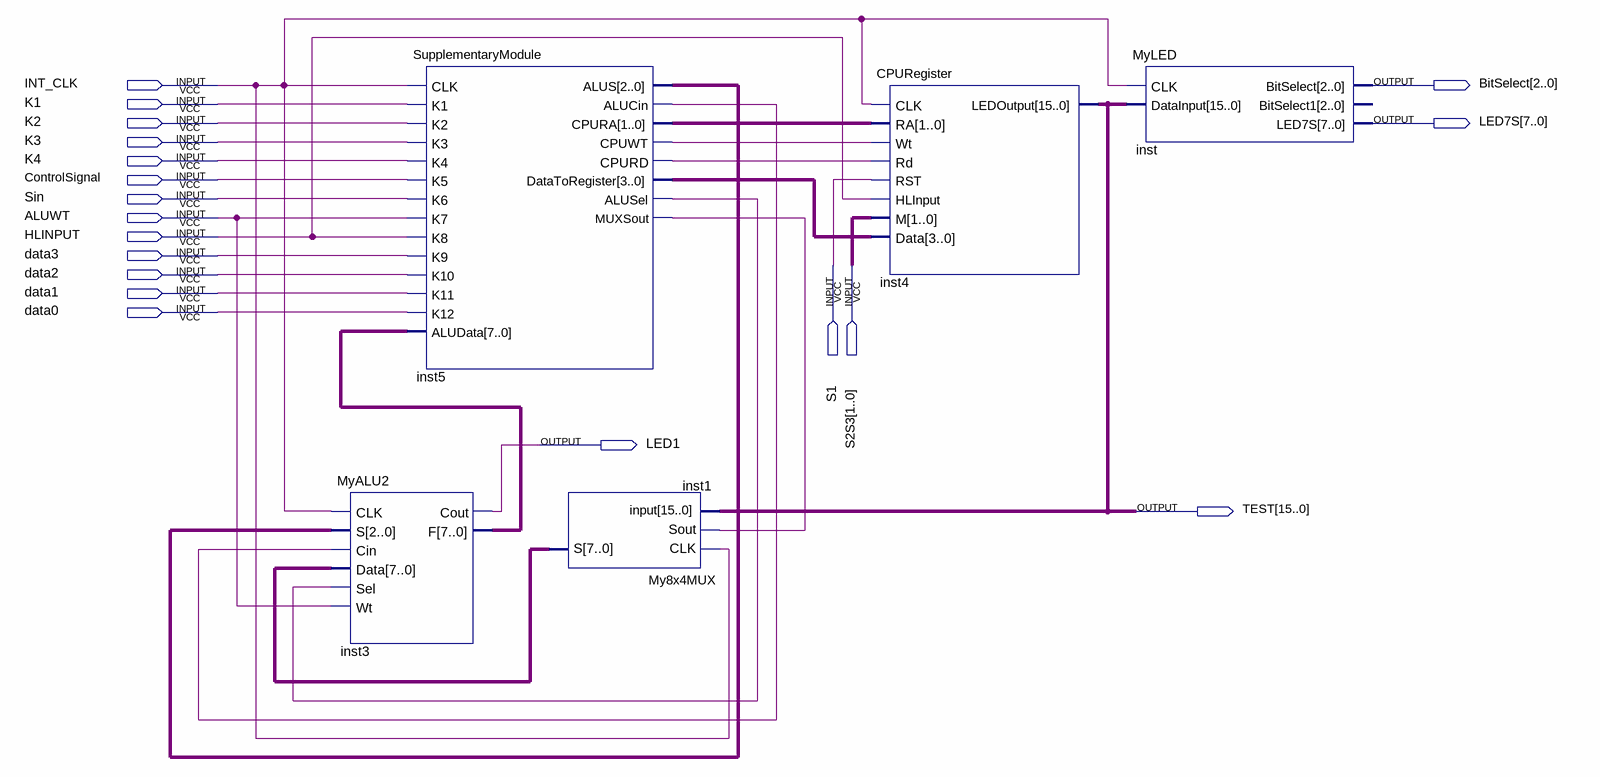
[diagram p0: schematic sheet]
// Quartus schematic ALUDesignTopLevelEntity.bdf as structural Verilog: 5 symbols, 19 pins
module ALUDesignTopLevelEntity (
  input  INT_CLK,
  input  K1,
  input  K2,
  input  K3,
  input  K4,
  input  ControlSignal,
  input  Sin,
  input  ALUWT,
  input  HLINPUT,
  input  data3,
  input  S1,
  input  [1:0] S2S3,
  input  data2,
  input  data1,
  input  data0,
  output [2:0] BitSelect,
  output [7:0] LED7S,
  output LED1,
  output [15:0] TEST
);

  wire inst5_alucin, inst5_alusel, inst5_cpurd, inst5_cpuwt, inst5_muxsout;
  wire [1:0] inst5_cpura;
  wire [2:0] inst5_alus;
  wire [3:0] inst5_datatoregister;
  wire [7:0] inst1_s, inst3_f;

  MyALU2 inst3 (
    .CLK(INT_CLK), .S(inst5_alus), .Cin(inst5_alucin), .Data(inst1_s), .Sel(inst5_alusel), .Wt(ALUWT),
    .Cout(LED1), .F(inst3_f));
  SupplementaryModule inst5 (
    .CLK(INT_CLK), .K1(K1), .K2(K2), .K3(K3), .K4(K4), .K5(ControlSignal), .K6(Sin), .K7(ALUWT),
    .K8(HLINPUT), .K9(data3), .K10(data2), .K11(data1), .K12(data0), .ALUData(inst3_f), .ALUS(inst5_alus),
    .ALUCin(inst5_alucin), .CPURA(inst5_cpura), .CPUWT(inst5_cpuwt), .CPURD(inst5_cpurd),
    .DataToRegister(inst5_datatoregister), .ALUSel(inst5_alusel), .MUXSout(inst5_muxsout));
  My8x4MUX inst1 (.CLK(INT_CLK), .Sout(inst5_muxsout), .\input (TEST), .S(inst1_s));
  CPURegister inst4 (
    .CLK(INT_CLK), .RA(inst5_cpura), .Wt(inst5_cpuwt), .Rd(inst5_cpurd), .RST(S1), .HLInput(HLINPUT),
    .M(S2S3), .Data(inst5_datatoregister), .LEDOutput(TEST));
  MyLED inst (.CLK(INT_CLK), .DataInput(TEST), .BitSelect(BitSelect), .LED7S(LED7S));  // open: BitSelect1
endmodule
